# EAGLE schematic AMG8854 (EAGLE 9.5.0)
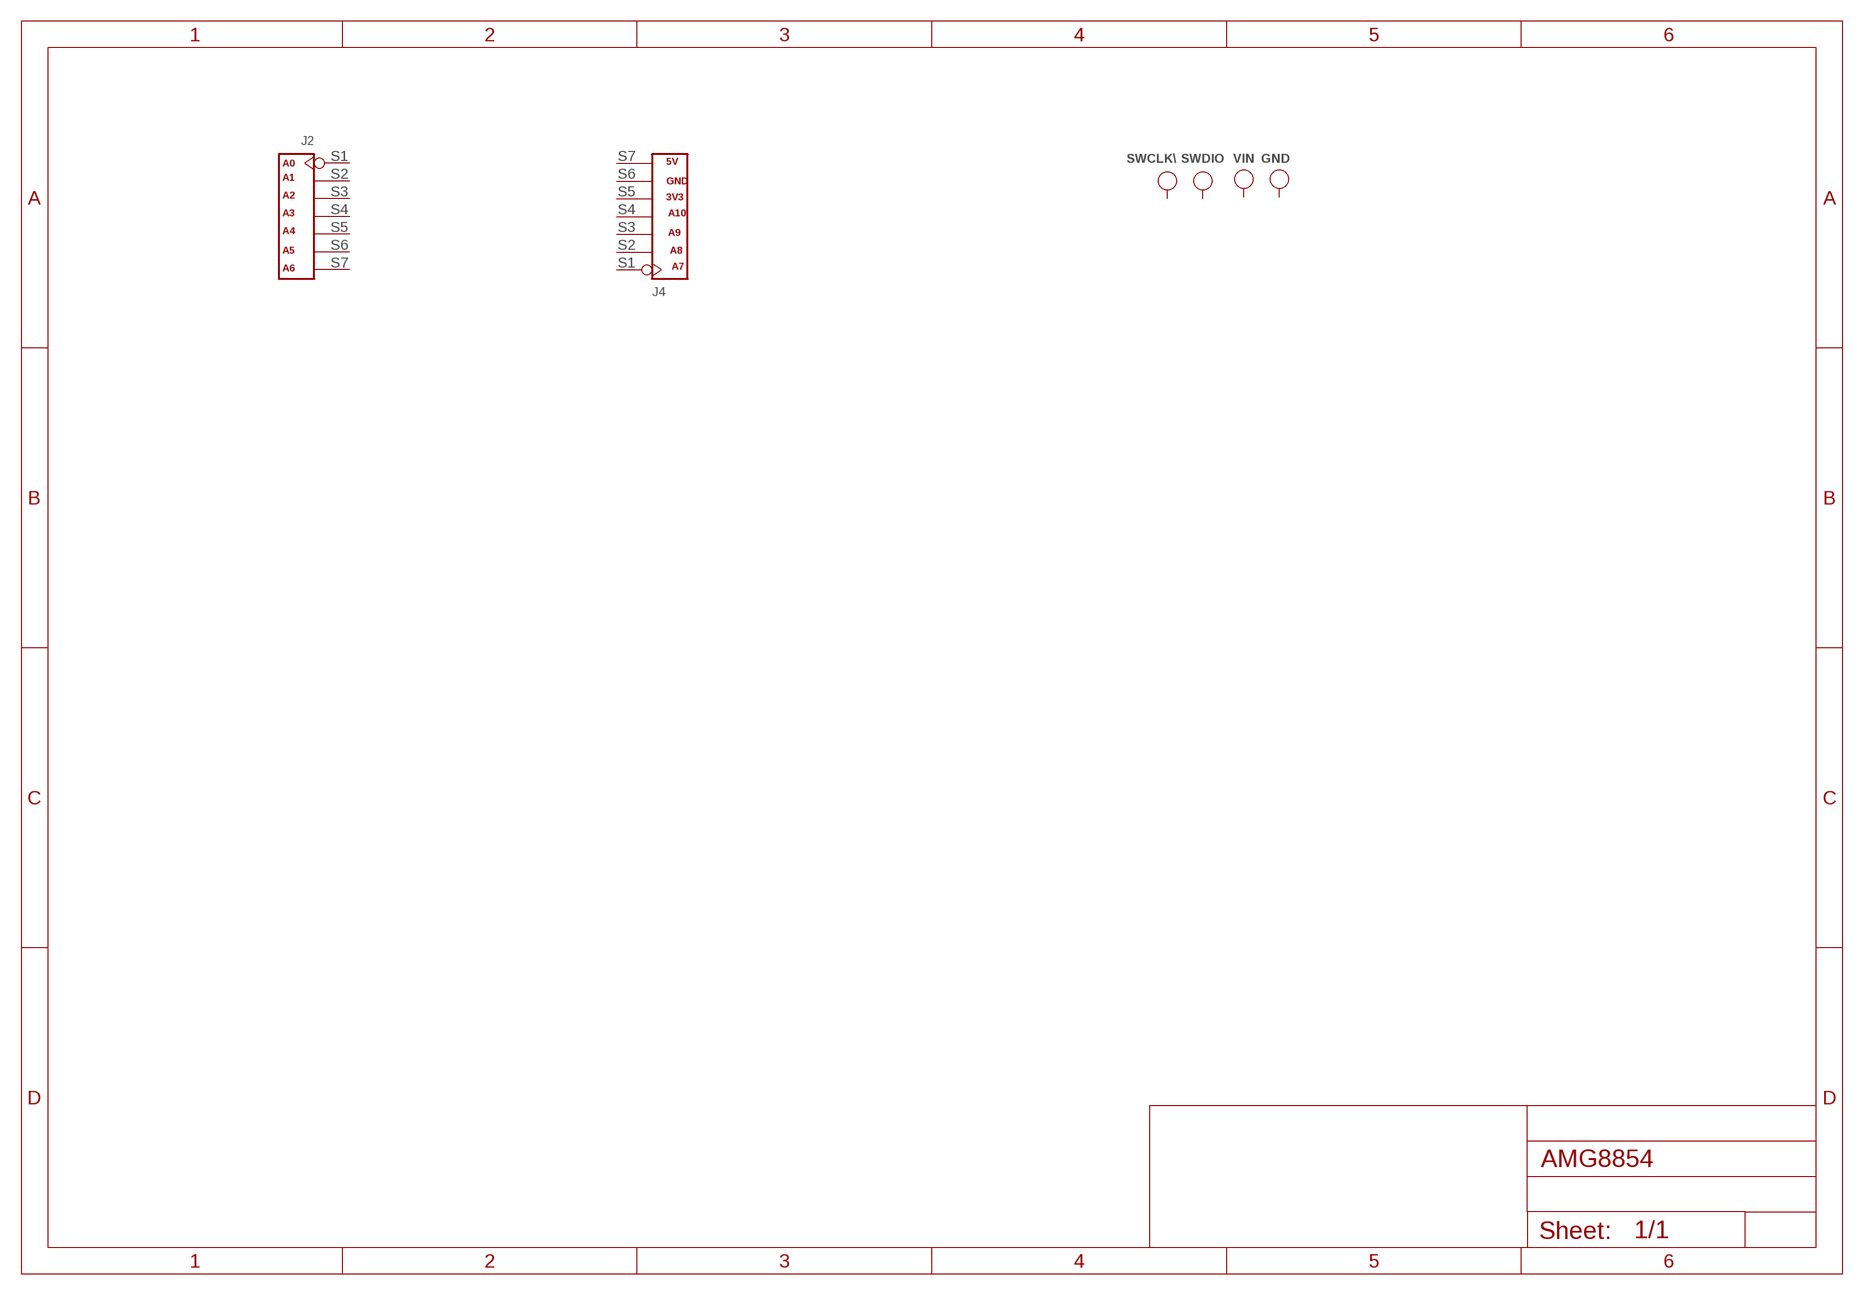
[diagram p0: schematic, sheet 1]

## Parts
GND  TEST-POINT'4080'  [TP-80X40MIL]
J2  DNP  CONNECTOR-NEW_HEADER-7P-HALF-HOLE  [CONNECTOR-V2]
J4  DNP  CONNECTOR-NEW_HEADER-7P-HALF-HOLE  [CONNECTOR-V2]
SWCLK\  TEST-POINT'4545'  [TP-D45MIL]
SWDIO  TEST-POINT'4545'  [TP-D45MIL]
VIN  TEST-POINT'4080'  [TP-80X40MIL]
Unconnected: GND.1(T) J2.S1 J2.S2 J2.S3 J2.S4 J2.S5 J2.S6 J2.S7 J4.S1 J4.S2 J4.S3 J4.S4 J4.S5 J4.S6 J4.S7 SWCLK\.T SWDIO.T VIN.1(T)

## Notes on the sheet
- A0 | 5V
- A1
- GND
- A2 | 3V3
- A3 | A10
- A4 | A9
- A5 | A8
- A6 | A7

## Library data of the parts
GND VIN = Discrete-new:TEST-POINT
J2 J4 = Seeeduino XIAO_v1.0_191112:CONNECTOR-NEW_HEADER-7P-HALF-HOLE
SWCLK\ SWDIO = Discrete-new:TEST-POINT; PARTNO: DNP

## Net classes
1 power: width 0.152 mm, drill 0.152 mm, clearance 0.152 mm
2 gnd: width 0.152 mm, drill 0.152 mm, clearance 0.152 mm
3 usbvcc: width 0.152 mm, drill 0.152 mm, clearance 0.152 mm